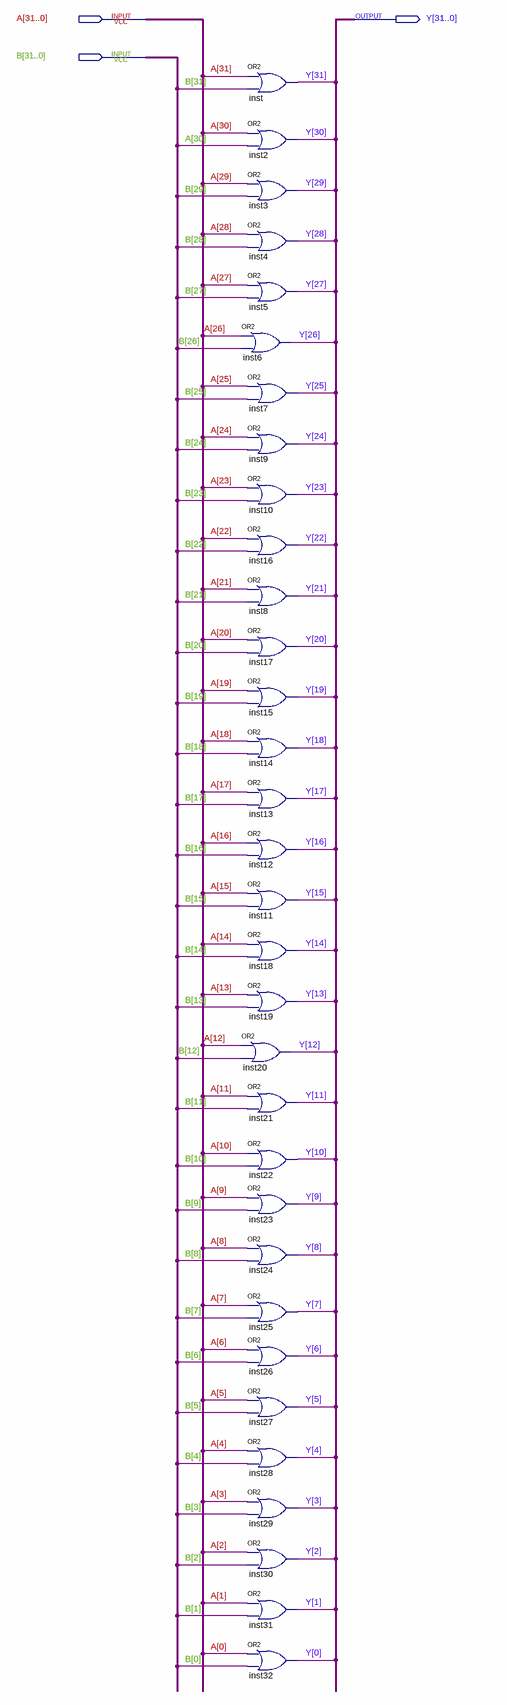
[diagram p0: schematic sheet]
// Quartus schematic OR_32.bdf as structural Verilog: 32 symbols, 3 pins
module OR_32 (
  input  [31:0] A,
  input  [31:0] B,
  output [31:0] Y
);

  or inst (Y[31], A[31], B[31]);
  or inst2 (Y[30], A[30], A[30]);
  or inst3 (Y[29], A[29], B[29]);
  or inst4 (Y[28], A[28], B[28]);
  or inst5 (Y[27], A[27], B[27]);
  or inst6 (Y[26], A[26], B[26]);
  or inst7 (Y[25], A[25], B[25]);
  or inst9 (Y[24], A[24], B[24]);
  or inst10 (Y[23], A[23], B[23]);
  or inst16 (Y[22], A[22], B[22]);
  or inst8 (Y[21], A[21], B[21]);
  or inst17 (Y[20], A[20], B[20]);
  or inst15 (Y[19], A[19], B[19]);
  or inst14 (Y[18], A[18], B[18]);
  or inst13 (Y[17], A[17], B[17]);
  or inst12 (Y[16], A[16], B[16]);
  or inst11 (Y[15], A[15], B[15]);
  or inst18 (Y[14], A[14], B[14]);
  or inst19 (Y[13], A[13], B[13]);
  or inst20 (Y[12], A[12], B[12]);
  or inst21 (Y[11], A[11], B[11]);
  or inst22 (Y[10], A[10], B[10]);
  or inst23 (Y[9], A[9], B[9]);
  or inst24 (Y[8], A[8], B[8]);
  or inst25 (Y[7], A[7], B[7]);
  or inst26 (Y[6], A[6], B[6]);
  or inst27 (Y[5], A[5], B[5]);
  or inst28 (Y[4], A[4], B[4]);
  or inst29 (Y[3], A[3], B[3]);
  or inst30 (Y[2], A[2], B[2]);
  or inst31 (Y[1], A[1], B[1]);
  or inst32 (Y[0], A[0], B[0]);
endmodule
